# EAGLE schematic L1_2025_v1.4 (EAGLE 9.6.2)

## Sheet 1 of 5
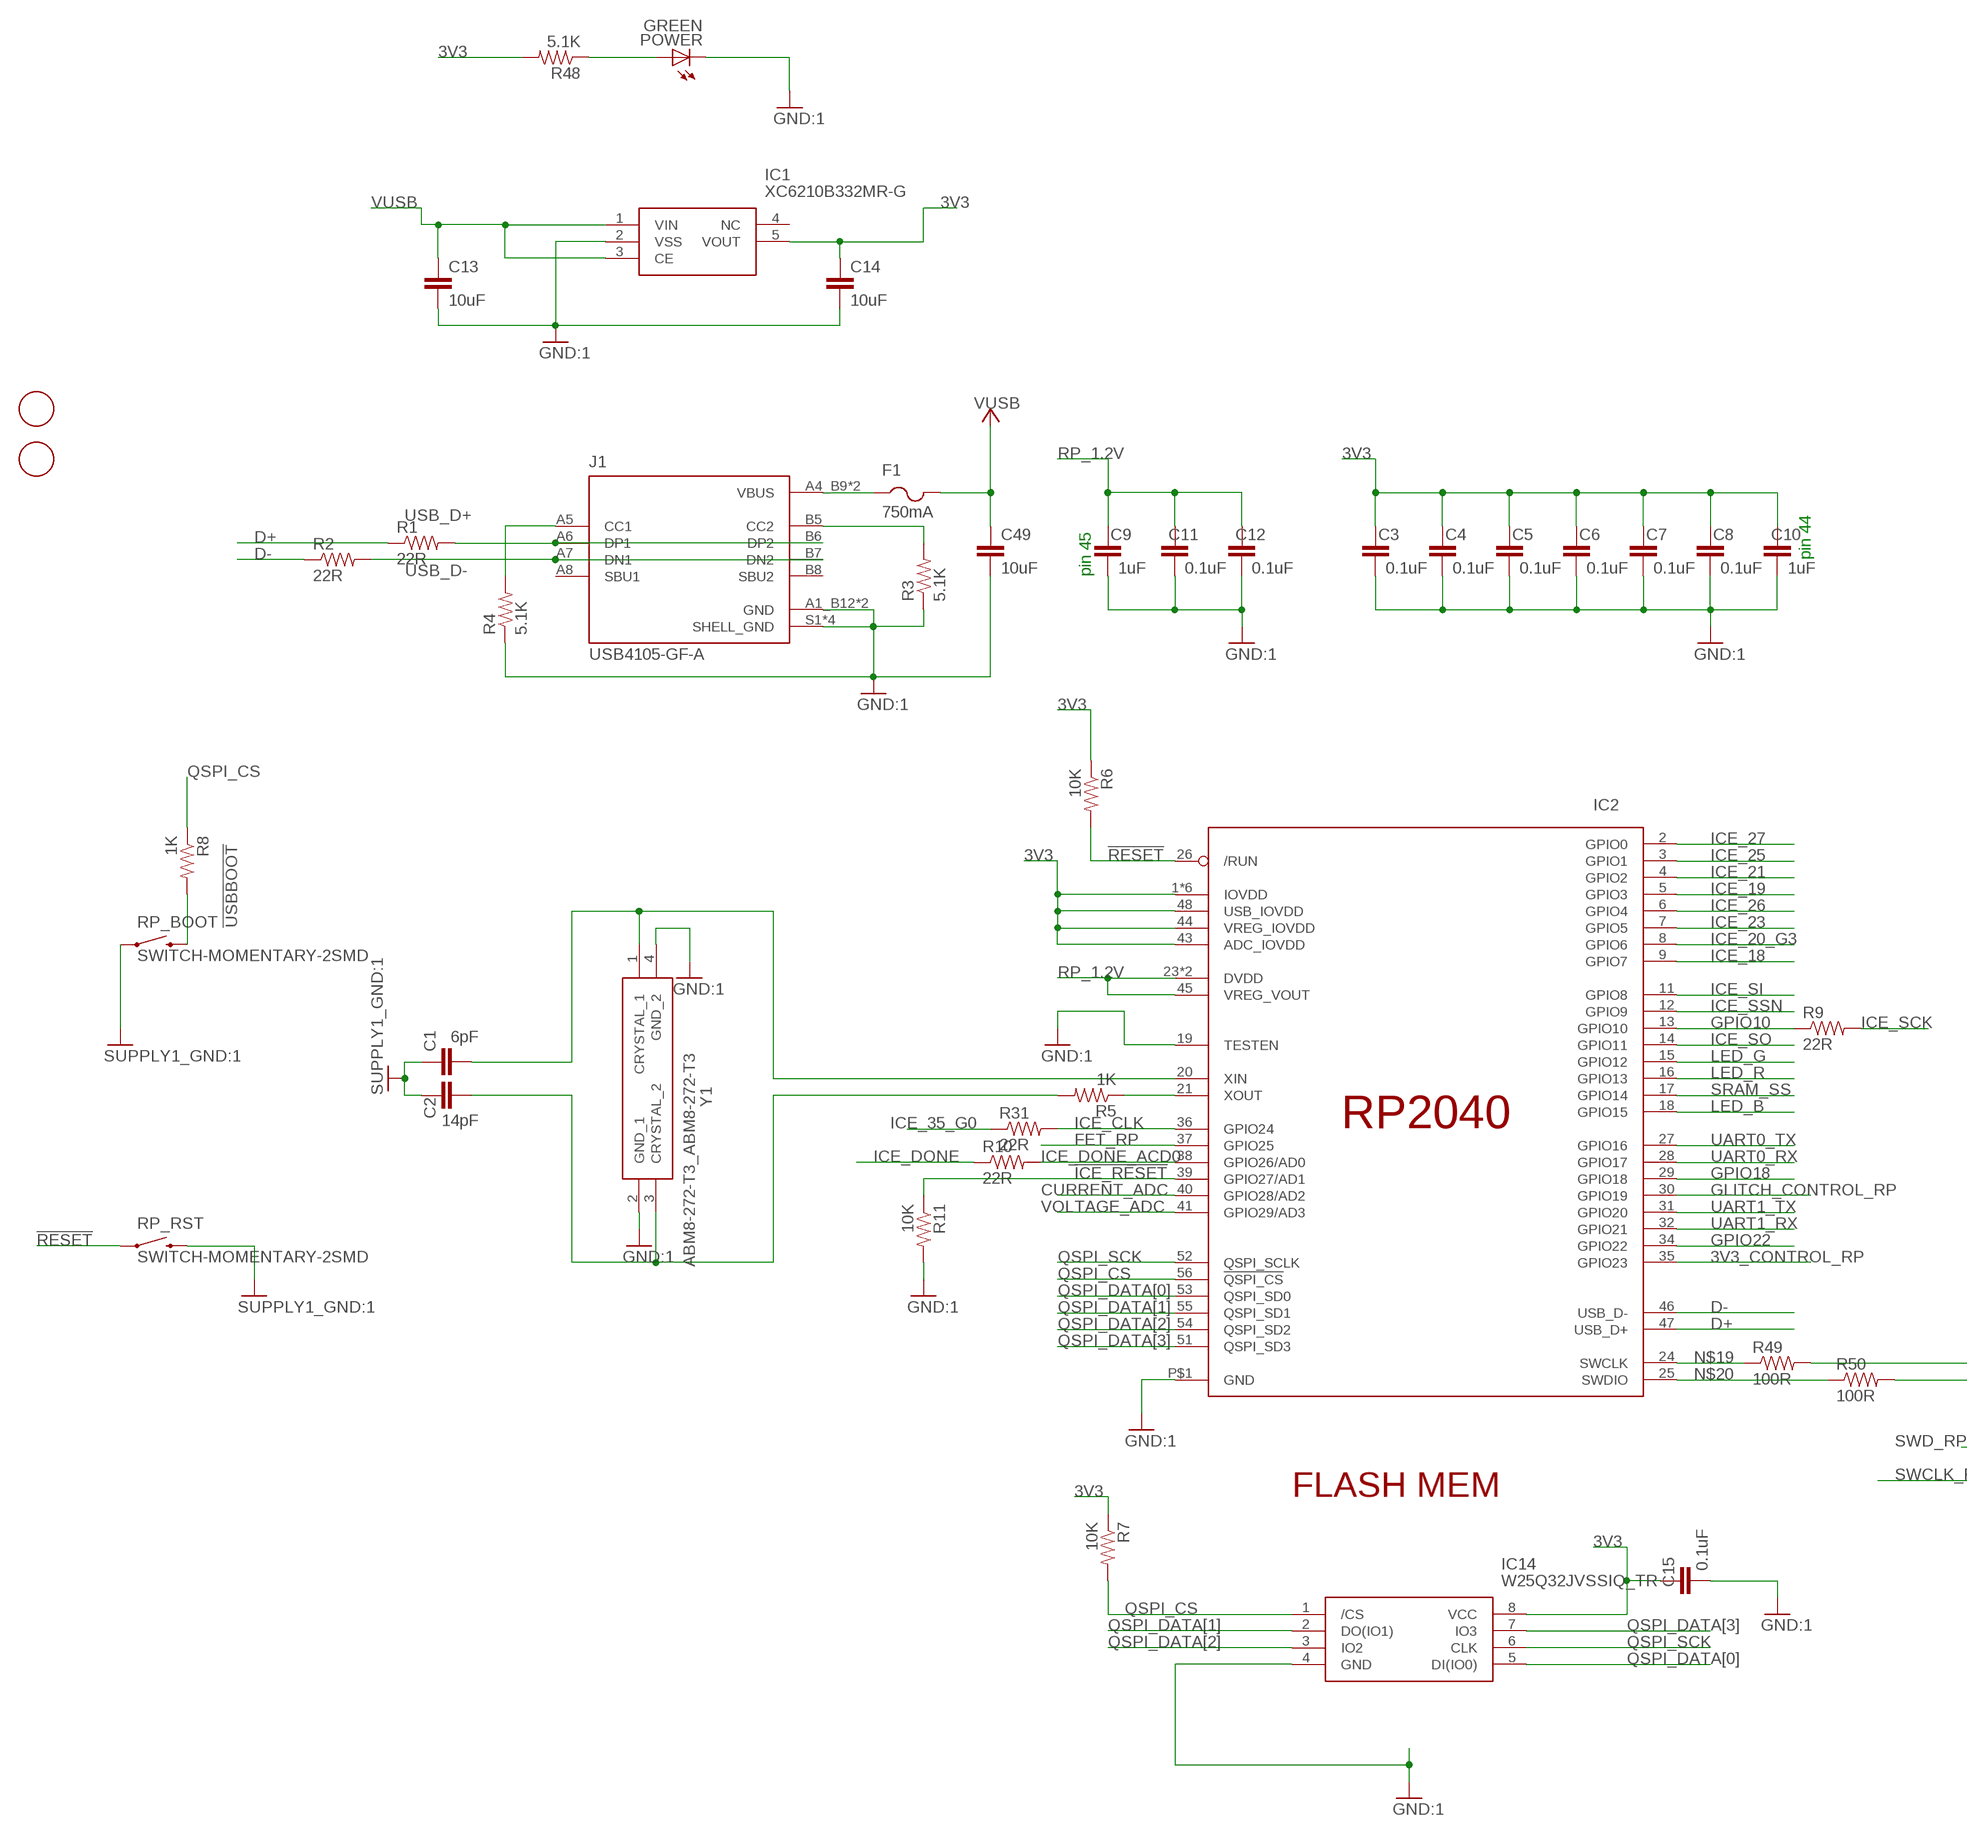
[diagram p0: schematic, sheet 1, part 1 of 2]
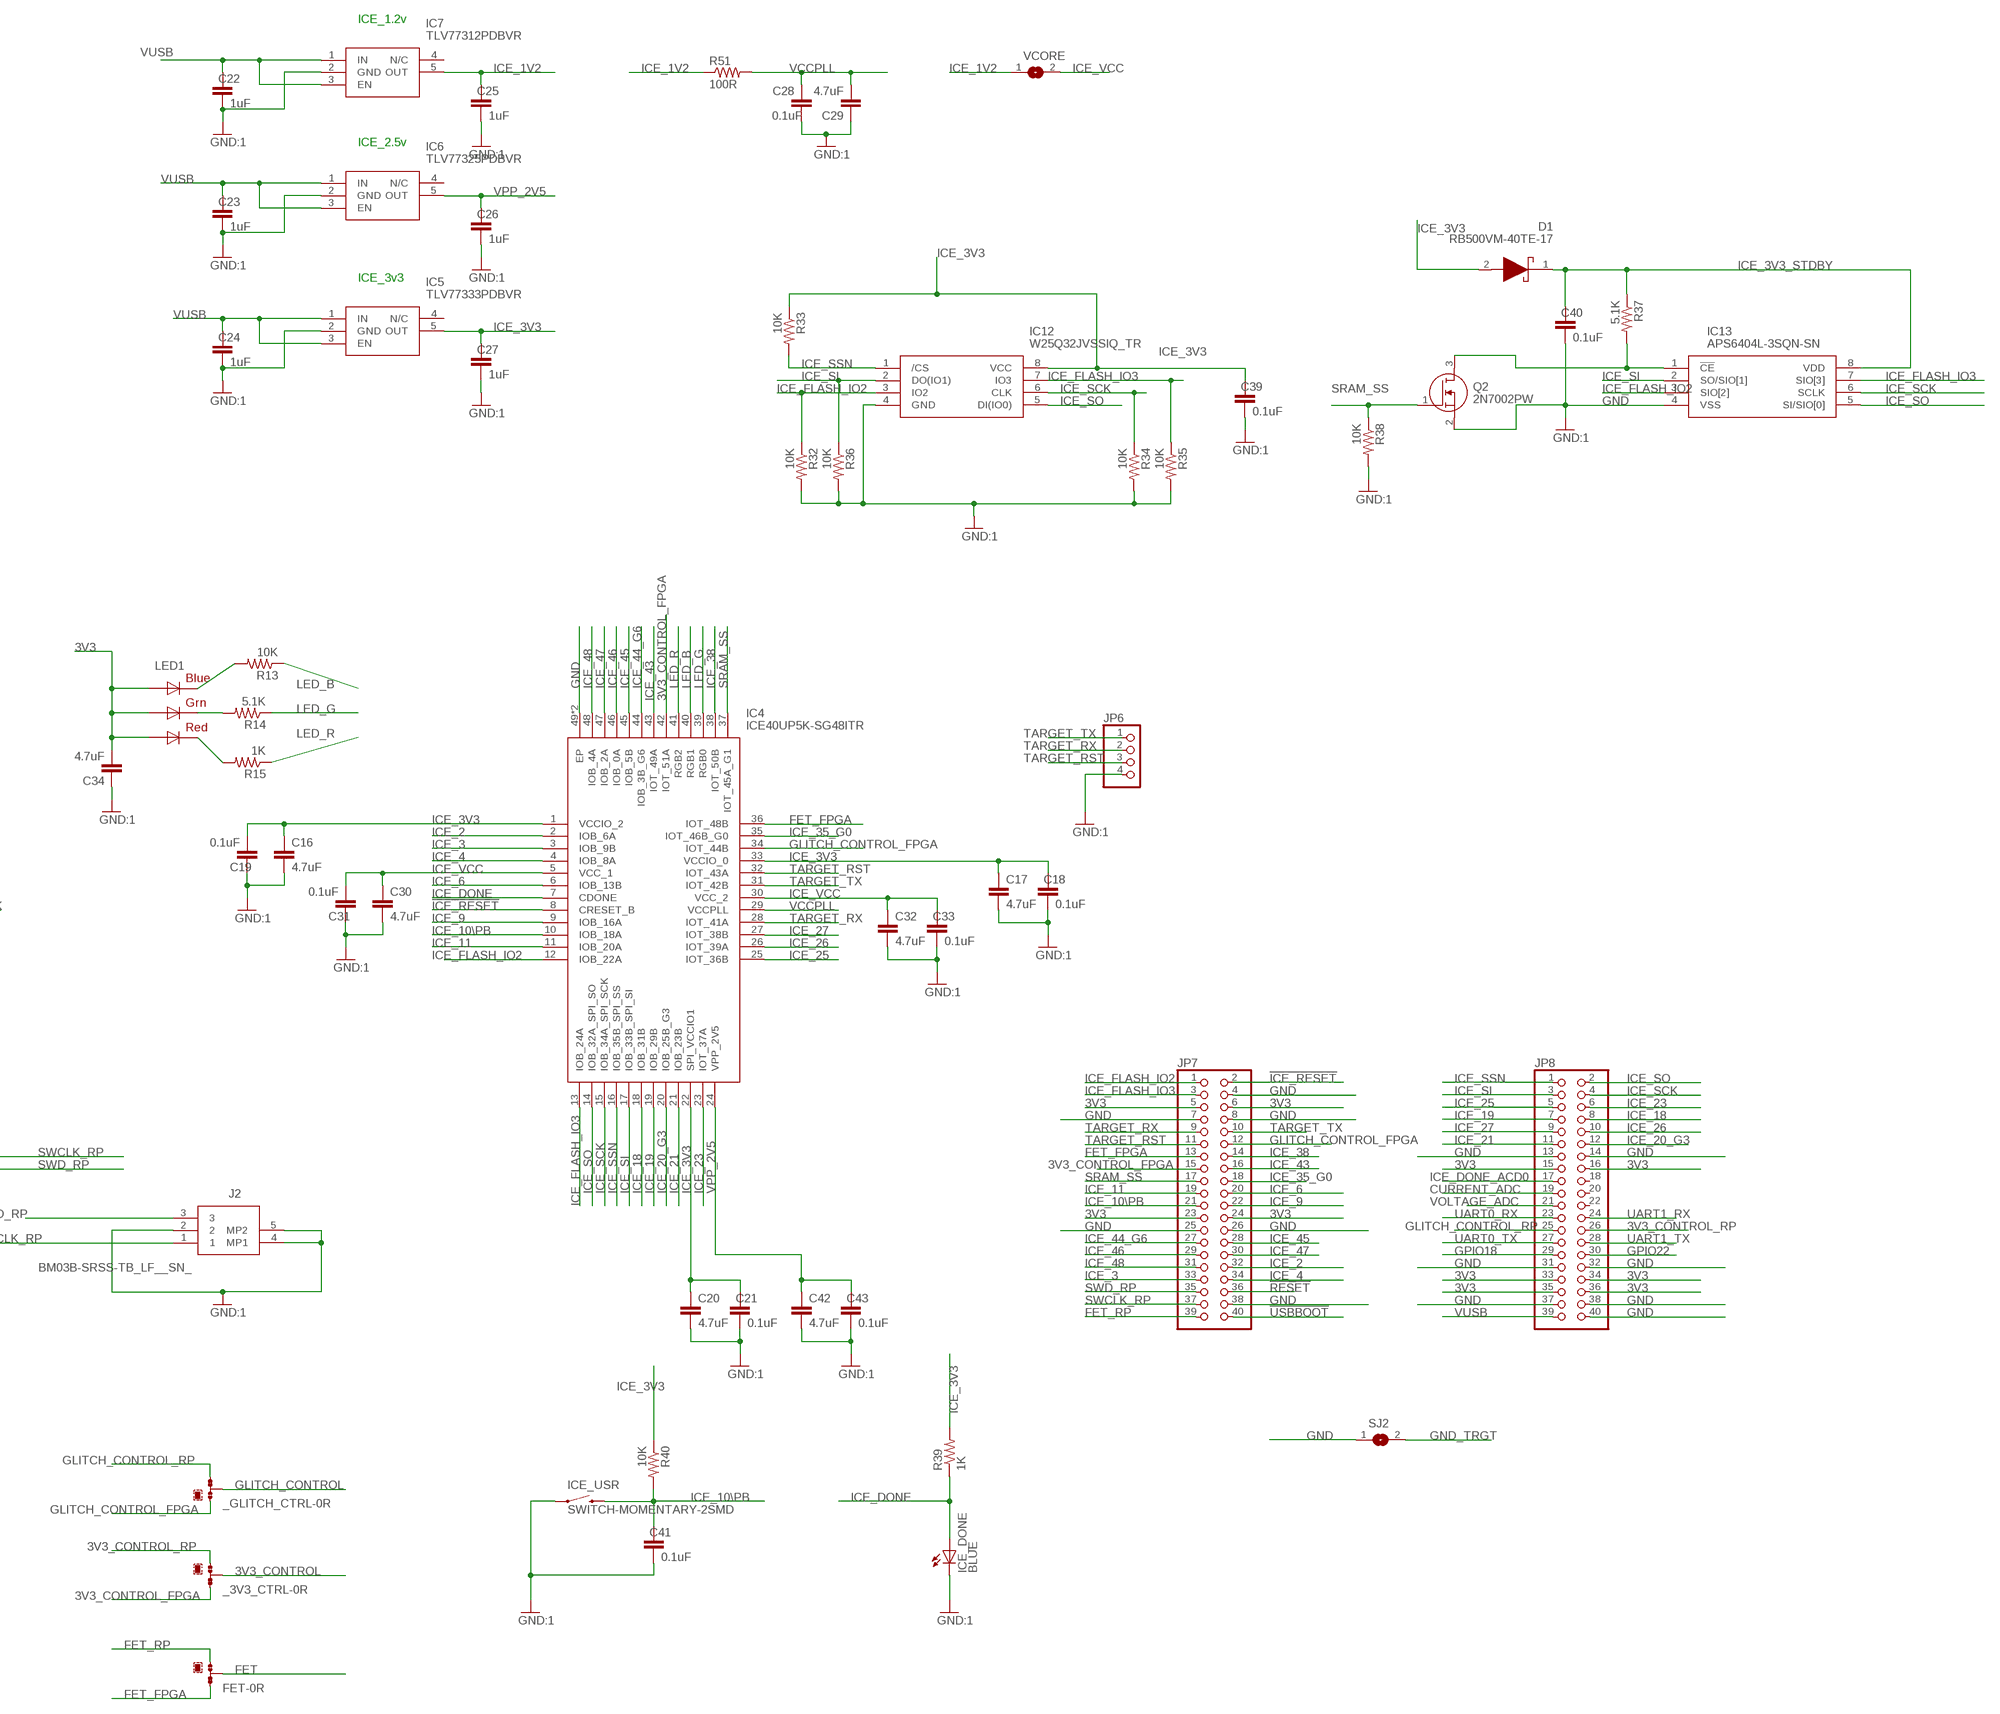
[diagram p1: schematic, sheet 1, part 2 of 2]

### Parts
_3V3_CTRL  0R-JUMPC  [C0R-JMP]
_GLITCH_CTRL  0R-JUMPC  [C0R-JMP]
AFID1  FIDUCIAL  [FIDUCIAL_1MM]
AFID2  FIDUCIAL  [FIDUCIAL_1MM]
C1  6pF  CAP0402-CAP  [0402-CAP]
C2  14pF  CAP0402-CAP  [0402-CAP]
C3  0.1uF  CAP0402-CAP  [0402-CAP]
C4  0.1uF  CAP0402-CAP  [0402-CAP]
C5  0.1uF  CAP0402-CAP  [0402-CAP]
C6  0.1uF  CAP0402-CAP  [0402-CAP]
C7  0.1uF  CAP0402-CAP  [0402-CAP]
C8  0.1uF  CAP0402-CAP  [0402-CAP]
C9  1uF  CAP0402-CAP  [0402-CAP]
C10  1uF  CAP0402-CAP  [0402-CAP]
C11  0.1uF  CAP0402-CAP  [0402-CAP]
C12  0.1uF  CAP0402-CAP  [0402-CAP]
C13  10uF  CAP0603-CAP  [0603-CAP]
C14  10uF  CAP0603-CAP  [0603-CAP]
C15  0.1uF  CAP0402-CAP  [0402-CAP]
C16  4.7uF  CAP0603-CAP  [0603-CAP]
C17  4.7uF  CAP0603-CAP  [0603-CAP]
C18  0.1uF  CAP0402-CAP  [0402-CAP]
C19  0.1uF  CAP0402-CAP  [0402-CAP]
C20  4.7uF  CAP0603-CAP  [0603-CAP]
C21  0.1uF  CAP0402-CAP  [0402-CAP]
C22  1uF  CAP0402-CAP  [0402-CAP]
C23  1uF  CAP0402-CAP  [0402-CAP]
C24  1uF  CAP0402-CAP  [0402-CAP]
C25  1uF  CAP0402-CAP  [0402-CAP]
C26  1uF  CAP0402-CAP  [0402-CAP]
C27  1uF  CAP0402-CAP  [0402-CAP]
C28  0.1uF  CAP0402-CAP  [0402-CAP]
C29  4.7uF  CAP0603-CAP  [0603-CAP]
C30  4.7uF  CAP0603-CAP  [0603-CAP]
C31  0.1uF  CAP0402-CAP  [0402-CAP]
C32  4.7uF  CAP0603-CAP  [0603-CAP]
C33  0.1uF  CAP0402-CAP  [0402-CAP]
C34  4.7uF  CAP0603-CAP  [0603-CAP]
C39  0.1uF  CAP0402-CAP  [0402-CAP]
C40  0.1uF  CAP0402-CAP  [0402-CAP]
C41  0.1uF  CAP0402-CAP  [0402-CAP]
C42  4.7uF  CAP0603-CAP  [0603-CAP]
C43  0.1uF  CAP0402-CAP  [0402-CAP]
C49  10uF  CAP0603-CAP  [0603-CAP]
D1  RB500VM-40TE-17  [RB500VM40TE17]
F1  750mA  PTCFUSE-1206  [R1206]
FET  0R-JUMPC  [C0R-JMP]
IC1  XC6210B332MR-G  [SOT95P280X130-5N]
IC2  ADAFRUIT_MICRO_RP2040_QFN56  [ADAFRUIT_MICRO_QFN56_7MM_REDUCEDEPAD]
IC4  ICE40UP5K-SG48ITR  [QFN50P700X700X100-49N]
IC5  TLV77333PDBVR  [SOT95P280X145-5N]
IC6  TLV77325PDBVR  [SOT95P280X145-5N]
IC7  TLV77312PDBVR  TLV77325PDBVR  [SOT95P280X145-5N]
IC12  W25Q32JVSSIQ_TR  [SOIC127P790X216-8N]
IC13  APS6404L-3SQN-SN  [SOIC127P600X175-8N]
IC14  W25Q32JVSSIQ_TR  [SOIC127P790X216-8N]
ICE_DONE  BLUE  LED1206  [LED-1206]
ICE_USR  SWITCH-MOMENTARY-2SMD  [TACTILE_SWITCH_SMD]
J1  USB4105-GF-A  [GCT_USB4105-GF-A]
J2  BM03B-SRSS-TB_LF__SN_  [BM03BSRSSTBLFSN]
JP6  PINHD-1X4  [1X04]
JP7  PINHD-2X20-BIG  [2X20-BIG]
JP8  PINHD-2X20-BIG  [2X20-BIG]
LED1  RGBLED5050  [RGBLED5050]
POWER  GREEN  LED1206  [LED-1206]
Q2  2N7002PW  [SOT65P210X110-3N]
R1  22R  RESISTOR0402-RES:1  [0402-RES:1]
R2  22R  RESISTOR0402-RES:1  [0402-RES:1]
R3  5.1K  RESISTOR0402-RES:1  [0402-RES:1]
R4  5.1K  RESISTOR0402-RES:1  [0402-RES:1]
R5  1K  RESISTOR0402-RES:1  [0402-RES:1]
R6  10K  RESISTOR0402-RES:1  [0402-RES:1]
R7  10K  RESISTOR0402-RES:1  [0402-RES:1]
R8  1K  RESISTOR0402-RES:1  [0402-RES:1]
R9  22R  RESISTOR0402-RES:1  [0402-RES:1]
R10  22R  RESISTOR0402-RES:1  [0402-RES:1]
R11  10K  RESISTOR0402-RES:1  [0402-RES:1]
R13  10K  RESISTOR0402-RES:1  [0402-RES:1]
R14  5.1K  RESISTOR0402-RES:1  [0402-RES:1]
R15  1K  RESISTOR0402-RES:1  [0402-RES:1]
R31  22R  RESISTOR0402-RES:1  [0402-RES:1]
R32  10K  RESISTOR0402-RES:1  [0402-RES:1]
R33  10K  RESISTOR0402-RES:1  [0402-RES:1]
R34  10K  RESISTOR0402-RES:1  [0402-RES:1]
R35  10K  RESISTOR0402-RES:1  [0402-RES:1]
R36  10K  RESISTOR0402-RES:1  [0402-RES:1]
R37  5.1K  RESISTOR0402-RES:1  [0402-RES:1]
R38  10K  RESISTOR0402-RES:1  [0402-RES:1]
R39  1K  RESISTOR0402-RES:1  [0402-RES:1]
R40  10K  RESISTOR0402-RES:1  [0402-RES:1]
R48  5.1K  RESISTOR0402-RES:1  [0402-RES:1]
R49  100R  RESISTOR0402-RES:1  [0402-RES:1]
R50  100R  RESISTOR0402-RES:1  [0402-RES:1]
R51  100R  RESISTOR0402-RES:1  [0402-RES:1]
RP_BOOT  SWITCH-MOMENTARY-2SMD  [TACTILE_SWITCH_SMD]
RP_RST  SWITCH-MOMENTARY-2SMD  [TACTILE_SWITCH_SMD]
SJ2  SJ  [SJ]
VCORE  SJ  [SJ]
Y1  ABM8-272-T3_ABM8-272-T3  [ABM8-272-T3_ABM8272T3]

### Nets
3V3: C3.2 C4.2 C5.2 C6.2 C7.2 C8.2 C10.2 C14.1 C15.2 C34.2 IC1.5(VOUT) IC2.1(IOVDD) IC2.10(IOVDD) IC2.22(IOVDD) IC2.33(IOVDD) IC2.42(IOVDD) IC2.43(ADC_IOVDD) IC2.44(VREG_IOVDD) IC2.48(USB_IOVDD) IC2.49(IOVDD) IC14.8(VCC) JP7.5 JP7.6 JP7.23 JP7.24 JP8.15 JP8.16 JP8.33 JP8.34 JP8.35 JP8.36 LED1.1(GREEN_A) LED1.2(RED_A) LED1.3(BLUE_A) R6.1 R7.1 R48.2 ; also sheet 2,3
3V3_CONTROL: _3V3_CTRL.2 ; also sheet 3
3V3_CONTROL_FPGA: _3V3_CTRL.3 IC4.42(IOT_51A) JP7.15
3V3_CONTROL_RP: _3V3_CTRL.1 IC2.35(GPIO23) JP8.26
!ICE_RESET: IC2.39(GPIO27/AD1) IC4.8(CRESET_B) JP7.2 R11.1
!RESET: IC2.26(/RUN) JP7.36 R6.2 RP_RST.1
!USBBOOT: JP7.40 R8.2 RP_BOOT.3
CURRENT_ADC: IC2.40(GPIO28/AD2) JP8.19 ; also sheet 4
D+: IC2.47(USB_D+) R1.1
D-: IC2.46(USB_D-) R2.1
FET: FET.2 ; also sheet 3
FET_FPGA: FET.3 IC4.36(IOT_48B) JP7.13
FET_RP: FET.1 IC2.37(GPIO25) JP7.39
GLITCH_CONTROL: _GLITCH_CTRL.2 ; also sheet 3
GLITCH_CONTROL_FPGA: _GLITCH_CTRL.3 IC4.34(IOT_44B) JP7.12
GLITCH_CONTROL_RP: _GLITCH_CTRL.1 IC2.30(GPIO19) JP8.25
GND: C1.1 C2.1 C3.1 C4.1 C5.1 C6.1 C7.1 C8.1 C9.1 C10.1 C11.1 C12.1 C13.2 C14.2 C15.1 C16.2 C17.2 C18.1 C19.2 C20.2 C21.1 C22.1 C23.1 C24.1 C25.1 C26.1 C27.1 C28.1 C29.1 C30.2 C31.2 C32.2 C33.1 C34.1 C39.1 C40.1 C41.1 C42.2 C43.1 C49.2 IC1.2(VSS) IC2.19(TESTEN) IC2.P$1(GND) IC4.49(EP) IC4.P$1(EP) IC5.2(GND) IC6.2(GND) IC7.2(GND) IC12.4(GND) IC13.4(VSS) IC14.4(GND) ICE_DONE.C ICE_USR.1 J1.A1_B12(GND) J1.B1_A12(GND) J1.S1(SHELL_GND) J1.S2(SHELL_GND) J1.S3(SHELL_GND) J1.S4(SHELL_GND) J2.2 J2.4(MP1) J2.5(MP2) JP6.4 JP7.4 JP7.7 JP7.8 JP7.25 JP7.26 JP7.38 JP8.13 JP8.14 JP8.31 JP8.32 JP8.37 JP8.38 JP8.40 POWER.C Q2.2(S) R3.1 R4.1 R11.2 R32.2 R34.2 R35.2 R36.2 R38.2 RP_BOOT.1 RP_RST.3 SJ2.1 Y1.2(GND_1) Y1.4(GND_2) ; supply symbol labelled GND:1, SUPPLY1_GND:1 ; also sheet 2,3,4
GND_TRGT: SJ2.2 ; also sheet 5
GPIO10: IC2.13(GPIO10) R9.1
GPIO18: IC2.29(GPIO18) JP8.29 ; also sheet 2
GPIO22: IC2.34(GPIO22) JP8.30 ; also sheet 2
ICE_1V2: C25.2 IC7.5(OUT) R51.1 VCORE.1
ICE_2: IC4.2(IOB_6A) JP7.32
ICE_3: IC4.3(IOB_9B) JP7.33
ICE_3V3: C16.1 C17.1 C18.2 C19.1 C20.1 C21.2 C27.2 C39.2 D1.2(A) IC4.1(VCCIO_2) IC4.22(SPI_VCCIO1) IC4.33(VCCIO_0) IC5.5(OUT) IC12.8(VCC) R33.1 R39.2 R40.1
ICE_3V3_STDBY: C40.2 D1.1(K) IC13.8(VDD) R37.1
ICE_4: IC4.4(IOB_8A) JP7.34
ICE_6: IC4.6(IOB_13B) JP7.20
ICE_9: IC4.9(IOB_16A) JP7.22
ICE_10\PB: C41.2 IC4.10(IOB_18A) ICE_USR.3 JP7.21 R40.2
ICE_11: IC4.11(IOB_20A) JP7.19
ICE_18: IC2.9(GPIO7) IC4.18(IOB_31B) JP8.8
ICE_19: IC2.5(GPIO3) IC4.19(IOB_29B) JP8.7
ICE_20_G3: IC2.8(GPIO6) IC4.20(IOB_25B_G3) JP8.12
ICE_21: IC2.4(GPIO2) IC4.21(IOB_23B) JP8.11
ICE_23: IC2.7(GPIO5) IC4.23(IOT_37A) JP8.6
ICE_25: IC2.3(GPIO1) IC4.25(IOT_36B) JP8.5
ICE_26: IC2.6(GPIO4) IC4.26(IOT_39A) JP8.10
ICE_27: IC2.2(GPIO0) IC4.27(IOT_38B) JP8.9
ICE_35_G0: IC4.35(IOT_46B_G0) JP7.18 R31.1
ICE_38: IC4.38(IOT_50B) JP7.14
ICE_43: IC4.43(IOT_49A) JP7.16
ICE_44_G6: IC4.44(IOB_3B_G6) JP7.27
ICE_45: IC4.45(IOB_5B) JP7.28
ICE_46: IC4.46(IOB_0A) JP7.29
ICE_47: IC4.47(IOB_2A) JP7.30
ICE_48: IC4.48(IOB_4A) JP7.31
ICE_CLK: IC2.36(GPIO24) R31.2
ICE_DONE: IC4.7(CDONE) ICE_DONE.A R10.1 R39.1
ICE_DONE_ACD0: IC2.38(GPIO26/AD0) JP8.17 R10.2
ICE_FLASH_IO2: IC4.12(IOB_22A) IC12.3(IO2) IC13.3(SIO[2]) JP7.1 R32.1
ICE_FLASH_IO3: IC4.13(IOB_24A) IC12.7(IO3) IC13.7(SIO[3]) JP7.3 R35.1
ICE_SCK: IC4.15(IOB_34A_SPI_SCK) IC12.6(CLK) IC13.6(SCLK) JP8.4 R9.2 R34.1
ICE_SI: IC2.11(GPIO8) IC4.17(IOB_33B_SPI_SI) IC12.2(DO(IO1)) IC13.2(SO/SIO[1]) JP8.3 R36.1
ICE_SO: IC2.14(GPIO11) IC4.14(IOB_32A_SPI_SO) IC12.5(DI(IO0)) IC13.5(SI/SIO[0]) JP8.2
ICE_SSN: IC2.12(GPIO9) IC4.16(IOB_35B_SPI_SS) IC12.1(/CS) JP8.1 R33.2
ICE_VCC: C30.1 C31.1 C32.1 C33.2 IC4.5(VCC_1) IC4.30(VCC_2) VCORE.2
LED_B: IC2.18(GPIO15) IC4.40(RGB1) R13.1
LED_G: IC2.15(GPIO12) IC4.39(RGB0) R14.1
LED_R: IC2.16(GPIO13) IC4.41(RGB2) R15.1
N$1: C2.2 R5.2 Y1.3(CRYSTAL_2)
N$2: IC2.21(XOUT) R5.1
N$3: C1.2 IC2.20(XIN) Y1.1(CRYSTAL_1)
N$4: LED1.4(BLUE_C) R13.2
N$5: LED1.6(GREEN_C) R14.2
N$6: LED1.5(RED_C) R15.2
N$7: J1.A5(CC1) R4.2
N$8: J1.B5(CC2) R3.2
N$16: IC13.1(!CE) Q2.3(D) R37.2
N$17: F1.1 J1.A4_B9(VBUS) J1.B4_A9(VBUS)
N$18: POWER.A R48.1
N$19: IC2.24(SWCLK) R49.1
N$20: IC2.25(SWDIO) R50.1
QSPI_CS: IC2.56(!QSPI_CS) IC14.1(/CS) R7.2 R8.1
QSPI_DATA[0]: IC2.53(QSPI_SD0) IC14.5(DI(IO0))
QSPI_DATA[1]: IC2.55(QSPI_SD1) IC14.2(DO(IO1))
QSPI_DATA[2]: IC2.54(QSPI_SD2) IC14.3(IO2)
QSPI_DATA[3]: IC2.51(QSPI_SD3) IC14.7(IO3)
QSPI_SCK: IC2.52(QSPI_SCLK) IC14.6(CLK)
RP_1.2V: C9.2 C11.2 C12.2 IC2.23(DVDD) IC2.45(VREG_VOUT) IC2.50(DVDD)
SRAM_SS: IC2.17(GPIO14) IC4.37(IOT_45A_G1) JP7.17 Q2.1(G) R38.1
SWCLK_RP: J2.1 JP7.37 R49.2
SWD_RP: J2.3 JP7.35 R50.2
TARGET_RST: IC4.32(IOT_43A) JP6.3 JP7.11
TARGET_RX: IC4.28(IOT_41A) JP6.2 JP7.9
TARGET_TX: IC4.31(IOT_42B) JP6.1 JP7.10
UART0_RX: IC2.28(GPIO17) JP8.23 ; also sheet 2
UART0_TX: IC2.27(GPIO16) JP8.27 ; also sheet 2
UART1_RX: IC2.32(GPIO21) JP8.24 ; also sheet 2
UART1_TX: IC2.31(GPIO20) JP8.28 ; also sheet 2
USB_D+: J1.A6(DP1) J1.B6(DP2) R1.2
USB_D-: J1.A7(DN1) J1.B7(DN2) R2.2
VCCPLL: C28.2 C29.2 IC4.29(VCCPLL) R51.2
VOLTAGE_ADC: IC2.41(GPIO29/AD3) JP8.21 ; also sheet 4
VPP_2V5: C26.2 C42.1 C43.2 IC4.24(VPP_2V5) IC6.5(OUT)
VUSB: C13.1 C22.2 C23.2 C24.2 C49.1 F1.2 IC1.1(VIN) IC1.3(CE) IC5.1(IN) IC5.3(EN) IC6.1(IN) IC6.3(EN) IC7.1(IN) IC7.3(EN) JP8.39 ; supply symbol labelled VCC:1 ; also sheet 3
Unconnected: IC1.4(NC) IC5.4(N/C) IC6.4(N/C) IC7.4(N/C) J1.A8(SBU1) J1.B8(SBU2) JP8.18 JP8.20 JP8.22

### Notes on the sheet
- ICE_1.2v
- ICE_2.5v
- ICE_3v3
- pin 44
- pin 45
- FLASH MEM

## Sheet 2 of 5
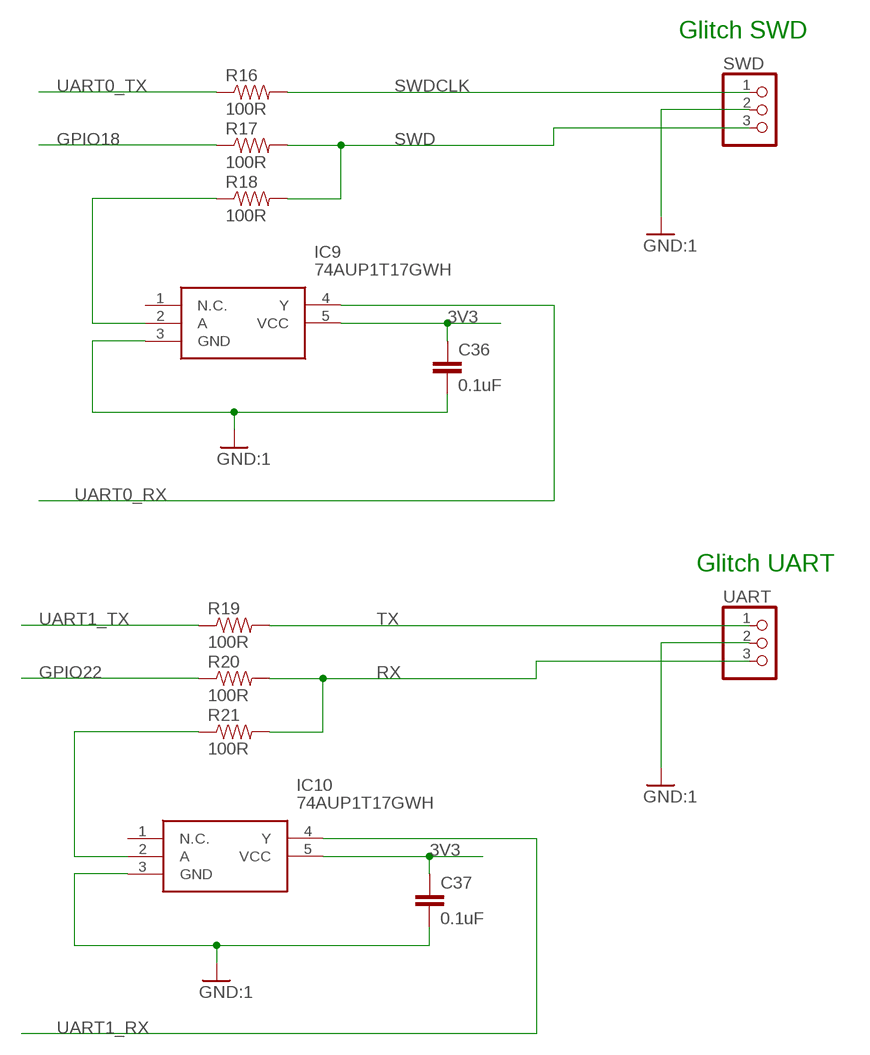
[diagram p2: schematic, sheet 2]

### Parts
C36  0.1uF  CAP0402-CAP  [0402-CAP]
C37  0.1uF  CAP0402-CAP  [0402-CAP]
IC9  74AUP1T17GWH  [SOT65P212X110-5N]
IC10  74AUP1T17GWH  [SOT65P212X110-5N]
R16  100R  RESISTOR0402-RES:1  [0402-RES:1]
R17  100R  RESISTOR0402-RES:1  [0402-RES:1]
R18  100R  RESISTOR0402-RES:1  [0402-RES:1]
R19  100R  RESISTOR0402-RES:1  [0402-RES:1]
R20  100R  RESISTOR0402-RES:1  [0402-RES:1]
R21  100R  RESISTOR0402-RES:1  [0402-RES:1]
SWD  PINHD-1X3  [1X03]
UART  PINHD-1X3  [1X03]

### Nets
3V3: C36.1 C37.1 IC9.5(VCC) IC10.5(VCC) ; also sheet 1,3
GND: C36.2 C37.2 IC9.3(GND) IC10.3(GND) SWD.2 UART.2 ; supply symbol labelled GND:1 ; also sheet 1,3,4
GPIO18: R17.1 ; also sheet 1
GPIO22: R20.1 ; also sheet 1
N$9: IC10.2(A) R21.1
N$12: IC9.2(A) R18.1
RX: R20.2 R21.2 UART.3
SWD: R17.2 R18.2 SWD.3
SWDCLK: R16.2 SWD.1
TX: R19.2 UART.1
UART0_RX: IC9.4(Y) ; also sheet 1
UART0_TX: R16.1 ; also sheet 1
UART1_RX: IC10.4(Y) ; also sheet 1
UART1_TX: R19.1 ; also sheet 1
Unconnected: IC9.1(N.C.) IC10.1(N.C.)

### Notes on the sheet
- Glitch SWD
- Glitch UART

## Sheet 3 of 5
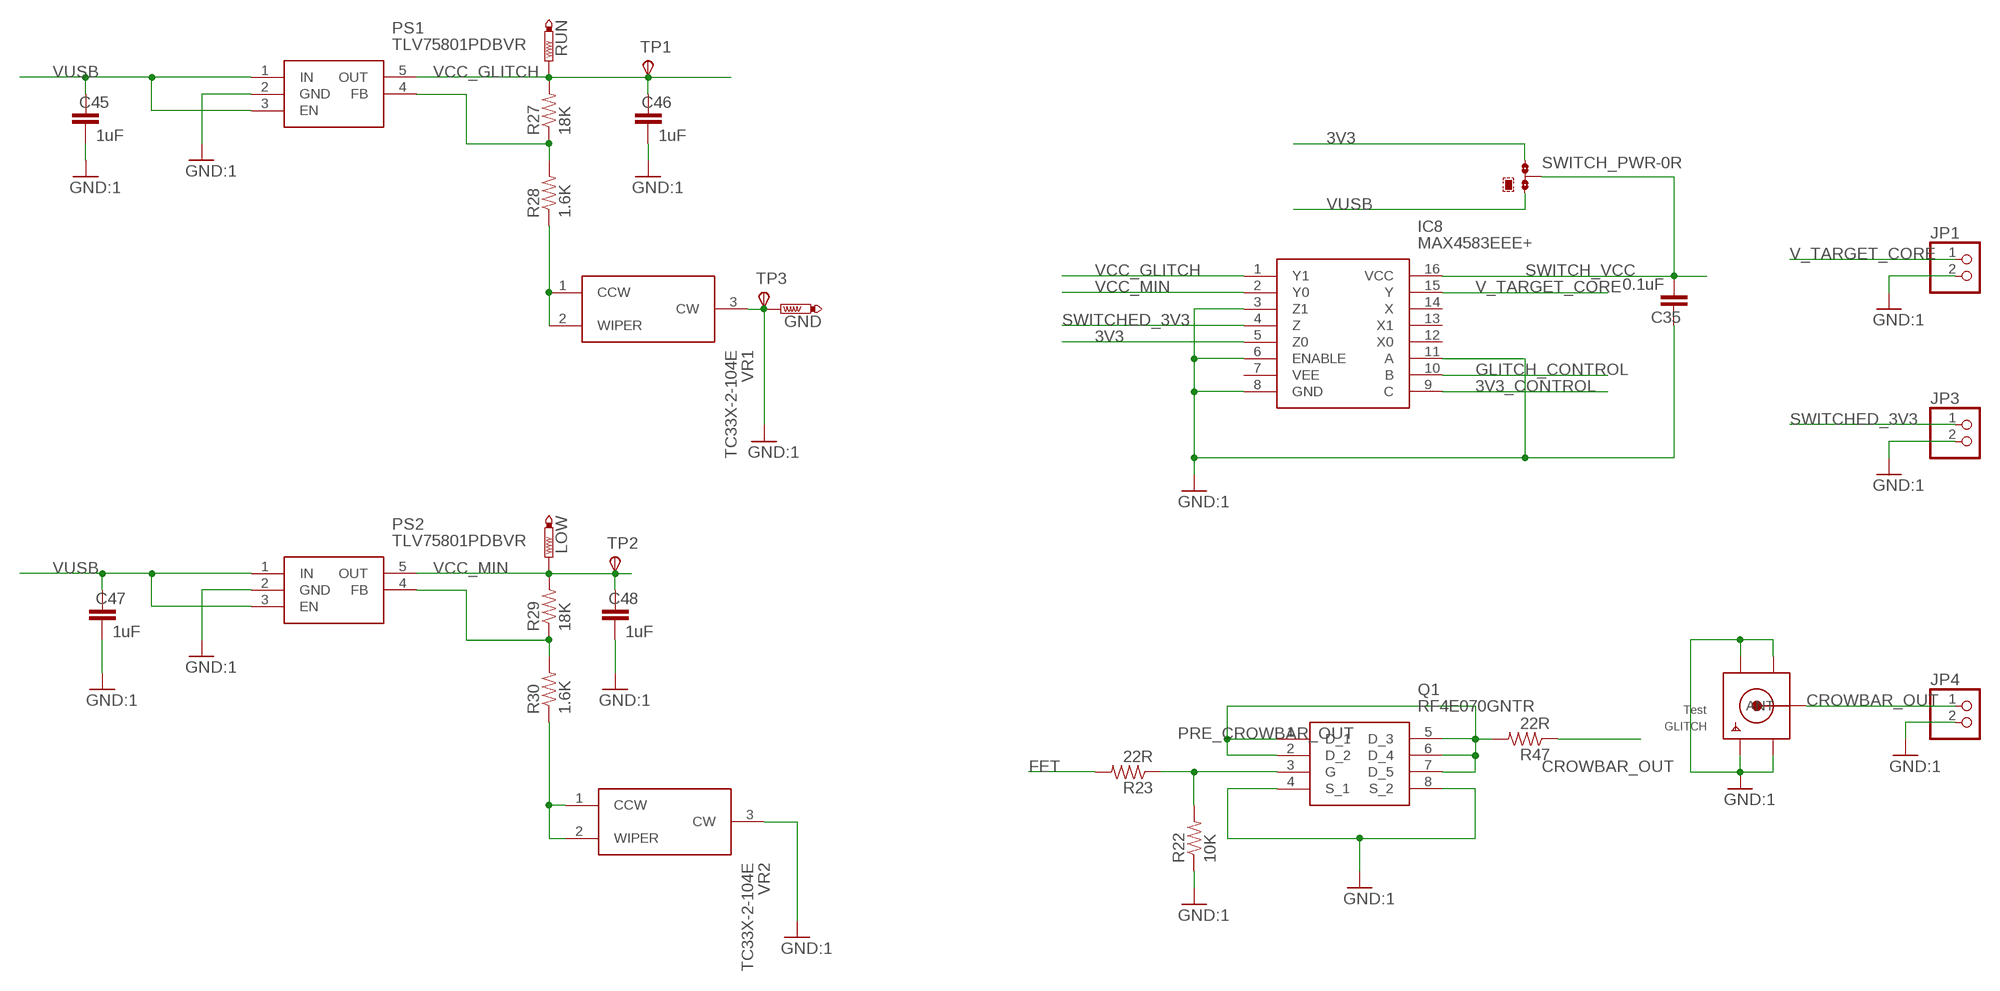
[diagram p3: schematic, sheet 3]

### Parts
C35  0.1uF  CAP0402-CAP  [0402-CAP]
C45  1uF  CAP0402-CAP  [0402-CAP]
C46  1uF  CAP0402-CAP  [0402-CAP]
C47  1uF  CAP0402-CAP  [0402-CAP]
C48  1uF  CAP0402-CAP  [0402-CAP]
GLITCH  Test  SMACONNECTOR_EDGE  [SMA_EDGELAUNCH]
GND  PTR1PAD1-13  [P1-13]
IC8  MAX4583EEE+  [SOP64P602X175-16N]
JP1  PINHD-1X2  [1X02]
JP3  PINHD-1X2  [1X02]
JP4  PINHD-1X2  [1X02]
LOW  PTR1PAD1-13  [P1-13]
PS1  TLV75801PDBVR  [SOT95P280X145-5N]
PS2  TLV75801PDBVR  [SOT95P280X145-5N]
Q1  RF4E070GNTR  [RF4E070GNTR]
R22  10K  RESISTOR0402-RES:1  [0402-RES:1]
R23  22R  RESISTOR0402-RES:1  [0402-RES:1]
R27  18K  RESISTOR0402-RES:1  [0402-RES:1]
R28  1.6K  RESISTOR0402-RES:1  [0402-RES:1]
R29  18K  RESISTOR0402-RES:1  [0402-RES:1]
R30  1.6K  RESISTOR0402-RES:1  [0402-RES:1]
R47  22R  RESISTOR0402-RES:1  [0402-RES:1]
RUN  PTR1PAD1-13  [P1-13]
SWITCH_PWR  0R-JUMPC  [C0R-JMP]
TP1  TESTPAD_TPSTP20R  [TESTPAD_TP20R:1]
TP2  TESTPAD_TPSTP20R  [TESTPAD_TP20R:1]
TP3  TESTPAD_TPSTP20R  [TESTPAD_TP20R:1]
VR1  TC33X-2-104E  [TC33X2503E]
VR2  TC33X-2-104E  [TC33X2503E]

### Nets
3V3: IC8.5(Z0) SWITCH_PWR.1 ; also sheet 1,2
3V3_CONTROL: IC8.9(C) ; also sheet 1
CROWBAR_OUT: GLITCH.P(ANT) JP4.1 R47.1
FET: R23.2 ; also sheet 1
GLITCH_CONTROL: IC8.10(B) ; also sheet 1
GND: C35.2 C45.1 C46.1 C47.1 C48.1 GLITCH.GND@1(GND4) GLITCH.GND@2(GND3) GLITCH.GND@3(GND2) GLITCH.GND@4(GND1) GND.TP IC8.3(Z1) IC8.6(ENABLE) IC8.8(GND) IC8.11(A) JP1.2 JP3.2 JP4.2 PS1.2(GND) PS2.2(GND) Q1.4(S_1) Q1.8(S_2) R22.1 TP3.TP(PP) VR1.3(CW) VR2.3(CW) ; supply symbol labelled GND:1 ; also sheet 1,2,4
N$10: PS1.4(FB) R27.1 R28.2
N$11: Q1.3(G) R22.2 R23.1
N$13: R28.1 VR1.1(CCW) VR1.2(WIPER)
N$14: PS2.4(FB) R29.1 R30.2
N$15: R30.1 VR2.1(CCW) VR2.2(WIPER)
PRE_CROWBAR_OUT: Q1.1(D_1) Q1.2(D_2) Q1.5(D_3) Q1.6(D_4) Q1.7(D_5) R47.2
SWITCH_VCC: C35.1 IC8.16(VCC) SWITCH_PWR.2
SWITCHED_3V3: IC8.4(Z) JP3.1
V_TARGET_CORE: IC8.15(Y) JP1.1
VCC_GLITCH: C46.2 IC8.1(Y1) PS1.5(OUT) R27.2 RUN.TP TP1.TP(PP)
VCC_MIN: C48.2 IC8.2(Y0) LOW.TP PS2.5(OUT) R29.2 TP2.TP(PP)
VUSB: C45.2 C47.2 PS1.1(IN) PS1.3(EN) PS2.1(IN) PS2.3(EN) SWITCH_PWR.3 ; also sheet 1
Unconnected: IC8.7(VEE) IC8.12(X0) IC8.13(X1) IC8.14(X)

## Sheet 4 of 5
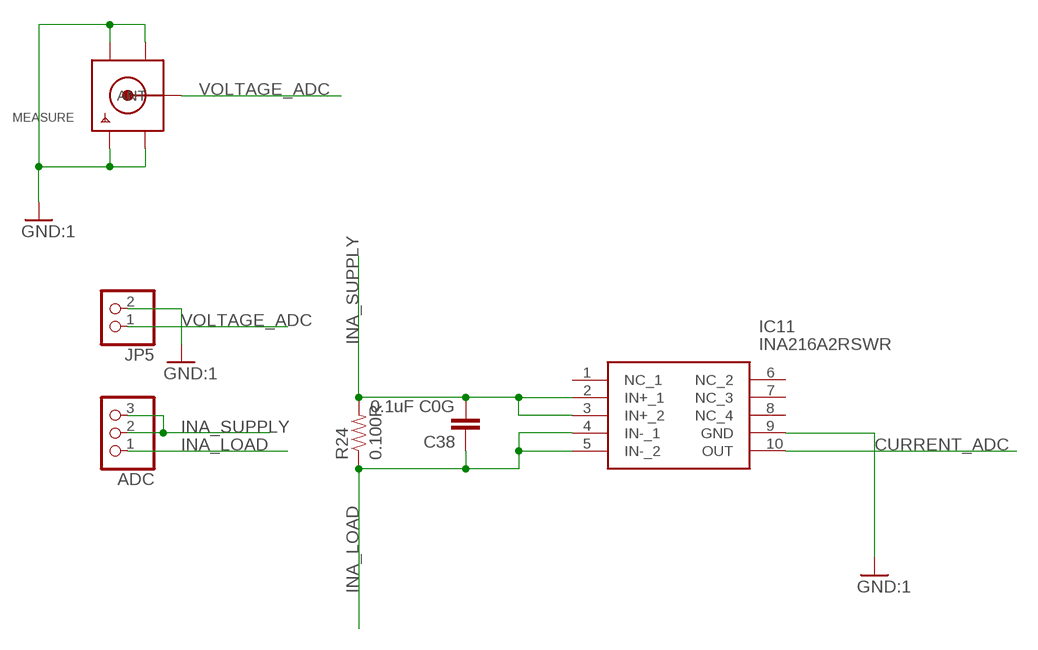
[diagram p4: schematic, sheet 4]

### Parts
ADC  PINHD-1X3:1  [1X03:1]
C38  0.1uF C0G  CAP0402-CAP  [0402-CAP]
IC11  INA216A2RSWR  [INA216A2RSWR]
JP5  PINHD-1X2  [1X02]
MEASURE  SMACONNECTOR_EDGE  [SMA_EDGELAUNCH]
R24  0.100R  RESISTOR2512:1  [R2512]

### Nets
CURRENT_ADC: IC11.10(OUT) ; also sheet 1
GND: IC11.9(GND) JP5.2 MEASURE.GND@1(GND4) MEASURE.GND@2(GND3) MEASURE.GND@3(GND2) MEASURE.GND@4(GND1) ; supply symbol labelled GND:1 ; also sheet 1,2,3
INA_LOAD: ADC.1 C38.1 IC11.4(IN-_1) IC11.5(IN-_2) R24.1
INA_SUPPLY: ADC.2 ADC.3 C38.2 IC11.2(IN+_1) IC11.3(IN+_2) R24.2
VOLTAGE_ADC: JP5.1 MEASURE.P(ANT) ; also sheet 1
Unconnected: IC11.1(NC_1) IC11.6(NC_2) IC11.7(NC_3) IC11.8(NC_4)

## Sheet 5 of 5
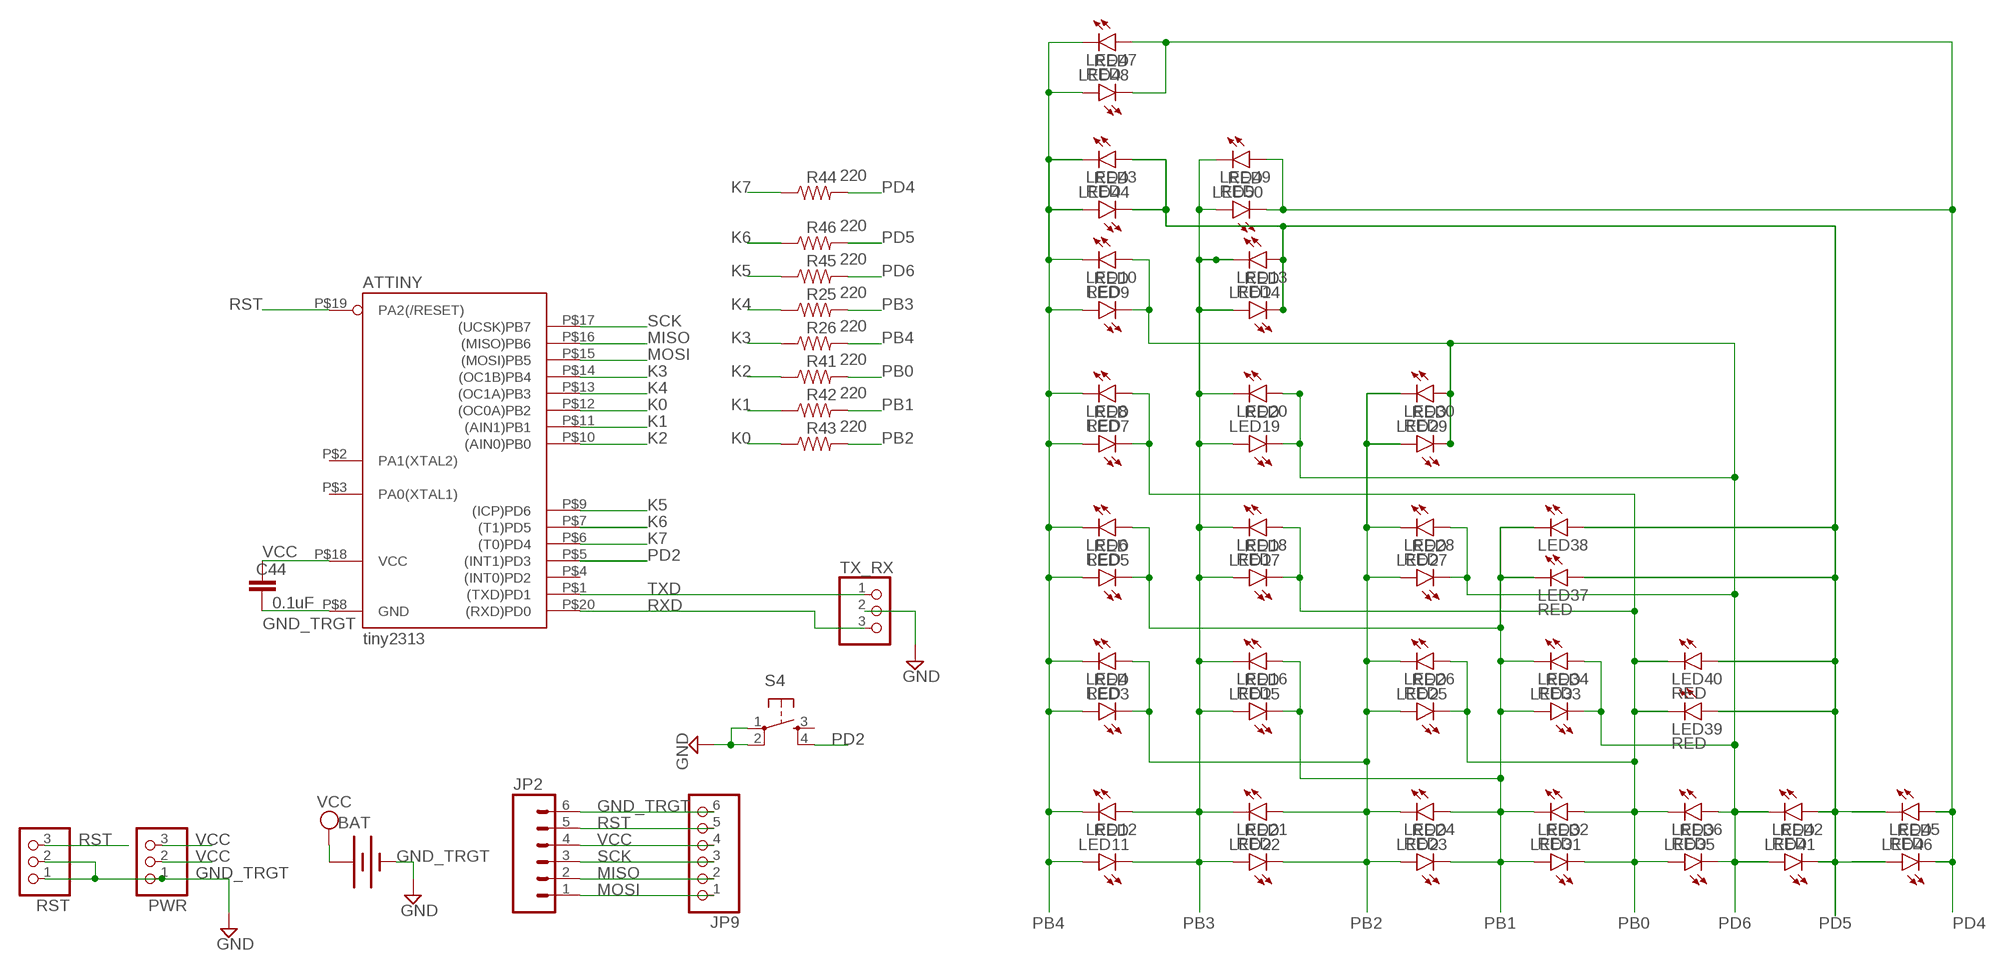
[diagram p5: schematic, sheet 5]

### Parts
ATTINY  tiny2313  TINY2313-*M*  [MLF20]
BAT  SPARKFUN_BATTERYSPARKFUN_BATTCOMM_20MM_LINX  [SPARKFUN_BATTCOM_20MM_LINX]
C44  0.1uF  CAP0402-CAP  [0402-CAP]
JP2  SPARKFUN-CONNECTORS_M06SMD-FEMALE-V2  [SPARKFUN-CONNECTORS_1X06-SMD-FEMALE-V2]
JP9  ADAFRUIT_PINHD-1X6CLEAN  [ADAFRUIT_1X06-CLEAN]
LED3  RED  LEDCHIPLED_1206:1  [CHIPLED_1206]
LED4  RED  LEDCHIPLED_1206:1  [CHIPLED_1206]
LED5  RED  LEDCHIPLED_1206:1  [CHIPLED_1206]
LED6  RED  LEDCHIPLED_1206:1  [CHIPLED_1206]
LED7  RED  LEDCHIPLED_1206:1  [CHIPLED_1206]
LED8  RED  LEDCHIPLED_1206:1  [CHIPLED_1206]
LED9  RED  LEDCHIPLED_1206:1  [CHIPLED_1206]
LED10  RED  LEDCHIPLED_1206:1  [CHIPLED_1206]
LED11  RED  LEDCHIPLED_1206:1  [CHIPLED_1206]
LED12  LEDCHIPLED_1206:1  [CHIPLED_1206]
LED13  RED  LEDCHIPLED_1206:1  [CHIPLED_1206]
LED14  RED  LEDCHIPLED_1206:1  [CHIPLED_1206]
LED15  RED  LEDCHIPLED_1206:1  [CHIPLED_1206]
LED16  RED  LEDCHIPLED_1206:1  [CHIPLED_1206]
LED17  RED  LEDCHIPLED_1206:1  [CHIPLED_1206]
LED18  RED  LEDCHIPLED_1206:1  [CHIPLED_1206]
LED19  RED  LEDCHIPLED_1206:1  [CHIPLED_1206]
LED20  LEDCHIPLED_1206:1  [CHIPLED_1206]
LED21  RED  LEDCHIPLED_1206:1  [CHIPLED_1206]
LED22  RED  LEDCHIPLED_1206:1  [CHIPLED_1206]
LED23  RED  LEDCHIPLED_1206:1  [CHIPLED_1206]
LED24  RED  LEDCHIPLED_1206:1  [CHIPLED_1206]
LED25  RED  LEDCHIPLED_1206:1  [CHIPLED_1206]
LED26  RED  LEDCHIPLED_1206:1  [CHIPLED_1206]
LED27  RED  LEDCHIPLED_1206:1  [CHIPLED_1206]
LED28  RED  LEDCHIPLED_1206:1  [CHIPLED_1206]
LED29  RED  LEDCHIPLED_1206:1  [CHIPLED_1206]
LED30  RED  LEDCHIPLED_1206:1  [CHIPLED_1206]
LED31  RED  LEDCHIPLED_1206:1  [CHIPLED_1206]
LED32  RED  LEDCHIPLED_1206:1  [CHIPLED_1206]
LED33  RED  LEDCHIPLED_1206:1  [CHIPLED_1206]
LED34  RED  LEDCHIPLED_1206:1  [CHIPLED_1206]
LED35  RED  LEDCHIPLED_1206:1  [CHIPLED_1206]
LED36  RED  LEDCHIPLED_1206:1  [CHIPLED_1206]
LED37  RED  LEDCHIPLED_1206:1  [CHIPLED_1206]
LED38  LEDCHIPLED_1206:1  [CHIPLED_1206]
LED39  RED  LEDCHIPLED_1206:1  [CHIPLED_1206]
LED40  RED  LEDCHIPLED_1206:1  [CHIPLED_1206]
LED41  RED  LEDCHIPLED_1206:1  [CHIPLED_1206]
LED42  RED  LEDCHIPLED_1206:1  [CHIPLED_1206]
LED43  RED  LEDCHIPLED_1206:1  [CHIPLED_1206]
LED44  RED  LEDCHIPLED_1206:1  [CHIPLED_1206]
LED45  RED  LEDCHIPLED_1206:1  [CHIPLED_1206]
LED46  RED  LEDCHIPLED_1206:1  [CHIPLED_1206]
LED47  RED  LEDCHIPLED_1206:1  [CHIPLED_1206]
LED48  RED  LEDCHIPLED_1206:1  [CHIPLED_1206]
LED49  RED  LEDCHIPLED_1206:1  [CHIPLED_1206]
LED50  RED  LEDCHIPLED_1206:1  [CHIPLED_1206]
PWR  PINHD-1X3  [1X03]
R25  220  RESISTOR  [0805]
R26  220  RESISTOR  [0805]
R41  220  RESISTOR  [0805]
R42  220  RESISTOR  [0805]
R43  220  RESISTOR  [0805]
R44  220  RESISTOR  [0805]
R45  220  RESISTOR  [0805]
R46  220  RESISTOR  [0805]
RST  PINHD-1X3  [1X03]
S4  TAC_SWITCHSMD  [TACTILE_SWITCH_SMD:1]
TX_RX  PINHD-1X3  [1X03]

### Nets
GND_TRGT: ATTINY.P$8(GND) BAT.2(-) C44.1 JP2.6 JP9.6 PWR.1 RST.1 RST.2 S4.1 S4.2 TX_RX.2 ; supply symbol labelled GND ; also sheet 1
K0 [LED]: ATTINY.P$12((OC0A)PB2) R43.1
K1 [LED]: ATTINY.P$11((AIN1)PB1) R42.1
K2 [LED]: ATTINY.P$10((AIN0)PB0) R41.1
K3 [LED]: ATTINY.P$14((OC1B)PB4) R26.1
K4 [LED]: ATTINY.P$13((OC1A)PB3) R25.1
K5: ATTINY.P$9((ICP)PD6) R45.1
K6: ATTINY.P$7((T1)PD5) R46.1
K7: ATTINY.P$6((T0)PD4) R44.1
MISO: ATTINY.P$16((MISO)PB6) JP2.2 JP9.2
MOSI: ATTINY.P$15((MOSI)PB5) JP2.1 JP9.1
PB0: LED7.C LED8.A LED17.C LED18.A LED25.C LED26.A LED31.C LED32.A LED35.A LED36.C LED39.C LED40.C R41.2
PB1: LED5.C LED6.A LED15.C LED16.A LED23.C LED24.A LED31.A LED32.C LED33.A LED34.C LED37.C LED38.C R42.2
PB2 [LED]: LED3.C LED4.A LED21.A LED22.C LED23.A LED24.C LED25.A LED26.C LED27.A LED28.C LED29.A LED30.C R43.2
PB3: LED11.C LED12.A LED13.C LED14.A LED15.A LED16.C LED17.A LED18.C LED19.A LED20.C LED21.C LED22.A LED49.C LED50.A R25.2
PB4: LED3.A LED4.C LED5.A LED6.C LED7.A LED8.C LED9.A LED10.C LED11.A LED12.C LED43.C LED44.A LED47.C LED48.A R26.2
PD2: ATTINY.P$5((INT1)PD3) S4.4
PD4: LED45.A LED46.C LED47.A LED48.C LED49.A LED50.C R44.2
PD5 [LED]: LED13.A LED14.C LED37.A LED38.A LED39.A LED40.A LED41.C LED42.A LED43.A LED44.C LED45.C LED46.A R46.2
PD6: LED9.C LED10.A LED19.C LED20.A LED27.C LED28.A LED29.C LED30.A LED33.C LED34.A LED35.C LED36.A LED41.A LED42.C R45.2
RST: ATTINY.P$19(PA2(/RESET)) JP2.5 JP9.5 RST.3
RXD: ATTINY.P$20((RXD)PD0) TX_RX.3
SCK: ATTINY.P$17((UCSK)PB7) JP2.3 JP9.3
TXD: ATTINY.P$1((TXD)PD1) TX_RX.1
VCC: ATTINY.P$18(VCC) BAT.1(+) C44.2 JP2.4 JP9.4 PWR.2 PWR.3
Unconnected: ATTINY.P$2(PA1(XTAL2)) ATTINY.P$3(PA0(XTAL1)) ATTINY.P$4((INT0)PD2) S4.3

## Library data of the parts
_3V3_CTRL _GLITCH_CTRL FET SWITCH_PWR = L1_2025_v1.3:0R-JUMP: SMD 0R 0805 Jumper
ADC = L1_2025_DevBoard_v1.2:PINHD-1X3*?:1: PIN HEADER
AFID1 AFID2 = L1_2025_v1.3:FIDUCIAL: For use by pick and place machines to calibrate the vision/machine, 1mm By microbuilder.eu
ATTINY = L1_2025_v1.3:TINY2313*: Atmel Tiny2313 2K Flash, 128 bytes EEPROM, 128 bytes RAM
BAT = L1_2025_v1.3:SPARKFUN_BATTERY: Battery Holders Various common sizes : AA, AAA, 20mm coin cell and 12mm coin cell.
C1-C49 = L1_2025_v1.3:CAP: Capacitor Standard 0603 ceramic capacitor, and 0.1" leaded capacitor.
D1 = L1_2025_v1.3:RB500VM-40TE-17: Schottky Diode 100mA 45V SOD-323FL Source: Datasheet <https://fscdn.rohm.com/en/products/databook/datasheet/discrete/diode/schottky_barrier/rb500vm-40te-17-e.pdf>; DESCRIPTION: Schottky Diode 100mA 45V SOD-323FL; HEIGHT: 0.9mm; MANUFACTURER_NAME: ROHM Semiconductor; MANUFACTURER_PART_NUMBER: RB500VM-40TE-17; MOUSER_PART_NUMBER: 755-RB500VM-40TE-17; MOUSER_PRICE-STOCK: https://www.mouser.co.uk/ProductDetail/ROHM-Semiconductor/RB500VM-40TE-17?qs=lrf6x%2Foh5fBhvDf%252BYRXs8Q%3D%3D
F1 = L1_2025_v1.3:PTCFUSE: PTC fuses, resettable thermistors
GLITCH MEASURE = L1_2025_v1.3:SMACONNECTOR: SMA Connector 90° DIP SMA Connector, 50 Ohm (4UConnector: 07259)
GND LOW RUN = L1_2025_v1.3:PTR1: TEST PIN
IC1 = L1_2025_v1.3:XC6210B332MR-G: LDO Voltage Regulators 700mA High Speed Votage Regulator Source: Datasheet <https://www.torexsemi.com/file/xc6210/XC6210.pdf>; DESCRIPTION: LDO Voltage Regulators 700mA High Speed Votage Regulator; HEIGHT: 1.3mm; MANUFACTURER_NAME: Torex; MANUFACTURER_PART_NUMBER: XC6210B332MR-G; MOUSER_PART_NUMBER: 865-XC6210B332MR-G; MOUSER_PRICE-STOCK: https://www.mouser.co.uk/ProductDetail/Torex-Semiconductor/XC6210B332MR-G?qs=AsjdqWjXhJ%2FS4LOuBYdYHQ%3D%3D
IC2 = L1_2025_v1.3:ADAFRUIT_MICRO_RP2040
IC4 = L1_2025_v1.3:ICE40UP5K-SG48ITR: FPGA - Field Programmable Gate Array iCE40-UltraPlus, 5280 LUTs, 1.2V Source: Datasheet <https://www.arrow.com/en/products/ice40up5k-sg48itr/lattice-semiconductor>; ARROW_PART_NUMBER: ICE40UP5K-SG48ITR; ARROW_PRICE-STOCK: https://www.arrow.com/en/products/ice40up5k-sg48itr/lattice-semiconductor?region=nac; DESCRIPTION: FPGA - Field Programmable Gate Array iCE40-UltraPlus, 5280 LUTs, 1.2V; HEIGHT: 1mm; MANUFACTURER_NAME: Lattice Semiconductor; MANUFACTURER_PART_NUMBER: ICE40UP5K-SG48ITR; MOUSER_PART_NUMBER: 842-40UP5KSG48ITR; MOUSER_PRICE-STOCK: https://www.mouser.com/Search/Refine.aspx?Keyword=842-40UP5KSG48ITR
IC5 = L1_2025_v1.3:TLV77333PDBVR: High PSRR: Up to 80dB 72dB (1kHz) 55dB (1MHz) VIN range: 1.4V to 5.5V Fixed output voltage range: 0.6V to 3.3V Output voltage accuracy: 2% Low dropout voltage: 180mV at 300mA (3.3VOUT, DQN package) Foldback current limit Active output pulldown resistor Source: Datasheet <https://www.ti.com/lit/ds/symlink/tlv773.pdf?ts=1724142940835&ref_url=https%3A%2F%2Fwww.mouser.in%2F>; DESCRIPTION: High PSRR: Up to 80dB 72dB (1kHz) 55dB (1MHz) VIN range: 1.4V to 5.5V Fixed output voltage range: 0.6V to 3.3V Output voltage accuracy: 2% Low dropout voltage: 180mV at 300mA (3.3VOUT, DQN package) Foldback current limit Active output pulldown resistor; HEIGHT: 1.45mm; MANUFACTURER_NAME: Texas Instruments; MANUFACTURER_PART_NUMBER: TLV77333PDBVR
IC6 IC7 = L1_2025_v1.3:TLV77325PDBVR: LDO Voltage Regulators 300-mA high-PSRR low-IQ low-dropout regulator with enable Source: Datasheet <https://www.mouser.com/ProductDetail/Texas-Instruments/TLV77325PDBVR?qs=i8QVZAFTkqRX2VRUOXqXsg==>; DESCRIPTION: LDO Voltage Regulators 300-mA high-PSRR low-IQ low-dropout regulator with enable; HEIGHT: 1.45mm; MANUFACTURER_NAME: Texas Instruments; MANUFACTURER_PART_NUMBER: TLV77325PDBVR; MOUSER_PART_NUMBER: 595-TLV77325PDBVR; MOUSER_PRICE-STOCK: https://www.mouser.co.uk/ProductDetail/Texas-Instruments/TLV77325PDBVR?qs=i8QVZAFTkqRX2VRUOXqXsg%3D%3D
IC8 = L1_2025_v1.3:MAX4583EEE+: Analogue Switch ICs Low-Voltage, CMOS Analog Multiplexers/Switches Source: Datasheet <https://datasheets.maximintegrated.com/en/ds/MAX4581-MAX4583.pdf>; DESCRIPTION: Analogue Switch ICs Low-Voltage, CMOS Analog Multiplexers/Switches; HEIGHT: 1.75mm; MANUFACTURER_NAME: Analog Devices; MANUFACTURER_PART_NUMBER: MAX4583EEE+; MOUSER_PART_NUMBER: 700-MAX4583EEE; MOUSER_PRICE-STOCK: https://www.mouser.co.uk/ProductDetail/Analog-Devices-Maxim-Integrated/MAX4583EEE%2b?qs=LHmEVA8xxfZWpGZ4exmtgg%3D%3D
IC9 IC10 = L1_2025_v1.3:74AUP1T17GWH: 74AUP1T17 - Low-power buffer with voltage-level translator@en-us Source: Datasheet <https://assets.nexperia.com/documents/data-sheet/74AUP1T17.pdf>; ARROW_PART_NUMBER: 74AUP1T17GWH; ARROW_PRICE-STOCK: https://www.arrow.com/en/products/74aup1t17gwh/nexperia?region=nac; DESCRIPTION: 74AUP1T17 - Low-power buffer with voltage-level translator@en-us; HEIGHT: 1.1mm; MANUFACTURER_NAME: Nexperia; MANUFACTURER_PART_NUMBER: 74AUP1T17GWH; MOUSER_PART_NUMBER: 771-74AUP1T17GWH; MOUSER_PRICE-STOCK: https://www.mouser.co.uk/ProductDetail/Nexperia/74AUP1T17GWH?qs=W0yvOO0ixfEkWoP8%252BUBOfA%3D%3D
IC11 = L1_2025_v1.3:INA216A2RSWR: 5V, Low-Power, High-side, Zero-Drift, Voltage Output Current Shunt Monitor in WCSP or QFN Package Source: Datasheet <http://www.ti.com/lit/gpn/ina216>; DESCRIPTION: 5V, Low-Power, High-side, Zero-Drift, Voltage Output Current Shunt Monitor in WCSP or QFN Package; HEIGHT: 0.5mm; MANUFACTURER_NAME: Texas Instruments; MANUFACTURER_PART_NUMBER: INA216A2RSWR; MOUSER_PART_NUMBER: 595-INA216A2RSWR; MOUSER_PRICE-STOCK: https://www.mouser.com/Search/Refine.aspx?Keyword=595-INA216A2RSWR
IC12 IC14 = L1_2025_v1.3:W25Q32JVSSIQ_TR: NOR Flash spiFlash, 32M-bit, DTR, 4Kb Uniform Sector Source: Datasheet <https://www.winbond.com/resource-files/w25q32jv spi revc 08302016.pdf>; ARROW_PART_NUMBER: W25Q32JVSSIQ TR; ARROW_PRICE-STOCK: https://www.arrow.com/en/products/w25q32jvssiqtr/winbond-electronics?utm_currency=USD&region=nac; DESCRIPTION: NOR Flash spiFlash, 32M-bit, DTR, 4Kb Uniform Sector; HEIGHT: 2.16mm; MANUFACTURER_NAME: Winbond; MANUFACTURER_PART_NUMBER: W25Q32JVSSIQ TR; MOUSER_PART_NUMBER: 454-W25Q32JVSSIQTR; MOUSER_PRICE-STOCK: https://www.mouser.co.uk/ProductDetail/Winbond/W25Q32JVSSIQ-TR?qs=qSfuJ%252Bfl%2Fd73AdQzQa%2FEuA%3D%3D
IC13 = L1_2025_v1.3:APS6404L-3SQN-SN: DRAM IoT RAM 64Mb QSPI (x1,x4) SDR 133MHz, 3V, Ind. Temp., SOP8 Source: Datasheet <https://www.apmemory.com/wp-content/uploads/APM_PSRAM_E3_QSPI-APS6404L-3SQN-v2.4-KGD_PKG.pdf>; DESCRIPTION: DRAM IoT RAM 64Mb QSPI (x1,x4) SDR 133MHz, 3V, Ind. Temp., SOP8; HEIGHT: 1.75mm; MANUFACTURER_NAME: AP Memory; MANUFACTURER_PART_NUMBER: APS6404L-3SQN-SN; MOUSER_PART_NUMBER: 878-APS6404L-3SQN-SN; MOUSER_PRICE-STOCK: https://www.mouser.co.uk/ProductDetail/AP-Memory/APS6404L-3SQN-SN?qs=IS%252B4QmGtzzqCot9%252BeIJwKw%3D%3D
ICE_DONE POWER = L1_2025_v1.3:LED: LEDs Standard schematic elements and footprints for 5mm, 3mm, 1206, and 0603 sized LEDs. 5mm - Spark Fun Electronics SKU : COM-00529 (and others)
ICE_USR RP_BOOT RP_RST = L1_2025_v1.3:SWITCH-MOMENTARY-2
J1 = L1_2025_v1.3:USB4105-GF-A: USB-C (USB TYPE-C) USB 2.0 Receptacle Connector 24 (16+8 Dummy) Position Surface Mount, Right Angle; Through Hole Check availability <https://pricing.snapeda.com/parts/USB4105-GF-A/GCT/view-part?ref=eda>; AVAILABILITY: In Stock; DESCRIPTION: USB-C (USB TYPE-C) USB 2.0 Receptacle Connector 24 (16+8 Dummy) Position Surface Mount, Right Angle; Through Hole; MF: GCT; MP: USB4105-GF-A; PACKAGE: None; PRICE: None; PURCHASE-URL: https://pricing.snapeda.com/search/part/USB4105-GF-A/?ref=eda
J2 = L1_2025_v1.3:BM03B-SRSS-TB_LF__SN_: Connector Header Surface Mount 3 position 0.039" (1.00mm) 1A 50V -25C ~ 85C Source: Datasheet <https://www.jst.com/wp-content/uploads/2021/03/eSR_SZ-new.pdf>; ARROW_PART_NUMBER: BM03B-SRSS-TB(LF)(SN); ARROW_PRICE-STOCK: https://www.arrow.com/en/products/bm03b-srss-tb-lf-sn/jst-manufacturing?region=europe; DESCRIPTION: Connector Header Surface Mount 3 position 0.039" (1.00mm) 1A 50V -25C ~ 85C; HEIGHT: 4.25mm; MANUFACTURER_NAME: JST (JAPAN SOLDERLESS TERMINALS); MANUFACTURER_PART_NUMBER: BM03B-SRSS-TB(LF)(SN); MOUSER_PART_NUMBER: 306-BM03BSRSSTBLFSNP; MOUSER_PRICE-STOCK: https://www.mouser.co.uk/ProductDetail/JST-Commercial/BM03B-SRSS-TBLFSN?qs=cdbOS8ANM9ApPnI10xgS6Q%3D%3D
JP1 JP3-JP5 = L1_2025_v1.3:PINHD-1X2: PIN HEADER
JP2 = L1_2025_v1.3:SPARKFUN-CONNECTORS_M06: Header 6 Standard 6-pin 0.1" header. Use with straight break away headers (SKU : PRT-00116), right angle break away headers (PRT-00553), swiss pins (PRT-00743), machine pins (PRT-00117), and female headers (PRT-00115). Molex polarized connector foot print use with SKU : PRT-08094 with associated crimp pins and housings. NOTES ON THE VARIANTS LOCK and LOCK_LONGPADS... This footprint was designed to help hold the alignment of a through-hole component (i.e. 6-pin header) while soldering it into place. You may notice that each hole has been shifted either up or down by 0.005 of an inch from it's more standard position (which is a perfectly straight line). This slight alteration caused the pins (the squares in the middle) to touch the edges of the holes. Because they are alternating, it causes a "brace" to hold the component in place. 0.005 has proven to be the perfect amount of "off-center" position when using our standard breakaway headers. Although looks a little odd when you look at the bare footprint, once you have a header in there, the alteration is very hard to notice. Also,if you push a header all the way into place, it is covered up entirely on the bottom side. This idea of altering the position of holes to aid alignment will be further integrated into the Sparkfun Library for other footprints. It can help hold any component with 3 or more connection pins.
JP6 = L1_2025_v1.3:PINHD-1X4: PIN HEADER
JP7 JP8 = L1_2025_v1.3:PINHD-2X20: PIN HEADER
JP9 = L1_2025_v1.3:ADAFRUIT_PINHD-1X6: PIN HEADER
LED1 = L1_2025_v1.3:RGBLED: For 5050 RGB LEDs, the order of the LEDs may vary from one manufacturer to another!
LED3-LED50 = L1_2025_DevBoard_v1.2:LED*?:1: LED OSRAM: - CHIPLED LG R971, LG N971, LY N971, LG Q971, LY Q971, LO R971, LY R971 LH N974, LH R974 LS Q976, LO Q976, LY Q976 LO Q996 - Hyper CHIPLED LW Q18S LB Q993, LB Q99A, LB R99A - SideLED LS A670, LO A670, LY A670, LG A670, LP A670 LB A673, LV A673, LT A673, LW A673 LH A674 LY A675 LS A676, LA A676, LO A676, LY A676, LW A676 LS A679, LY A679, LG A679 - Hyper Micro SIDELED® LS Y876, LA Y876, LO Y876, LY Y876 LT Y87S - SmartLED LW L88C, LW L88S LB L89C, LB L89S, LG L890 LS L89K, LO L89K, LY L89K LS L896, LA L896, LO L896, LY L896 - TOPLED LS T670, LO T670, LY T670, LG T670, LP T670 LSG T670, LSP T670, LSY T670, LOP T670, LYG T670 LG T671, LOG T671, LSG T671 LB T673, LV T673, LT T673, LW T673 LH T674 LS T676, LA T676, LO T676, LY T676, LB T676, LH T676, LSB T676, LW T676 LB T67C, LV T67C, LT T67C, LS T67K, LO T67K, LY T67K, LW E67C LS E67B, LA E67B, LO E67B, LY E67B, LB E67C, LV E67C, LT E67C LW T67C LS T679, LY T679, LG T679 LS T770, LO T770, LY T770, LG T770, LP T770 LB T773, LV T773, LT T773, LW T773 LH T774 LS E675, LA E675, LY E675, LS T675 LS T776, LA T776, LO T776, LY T776, LB T776 LHGB T686 LT T68C, LB T68C - Hyper Mini TOPLED® LB M676 - Mini TOPLED Santana® LG M470 LS M47K, LO M47K, LY M47K Source: http://www.osram.convergy.de LUXEON: - LUMILED® LXK2-PW12-R00, LXK2-PW12-S00, LXK2-PW14-U00, LXK2-PW14-V00 LXK2-PM12-R00, LXK2-PM12-S00, LXK2-PM14-U00 LXK2-PE12-Q00, LXK2-PE12-R00, LXK2-PE12-S00, LXK2-PE14-T00, LXK2-PE14-U00 LXK2-PB12-K00, LXK2-PB12-L00, LXK2-PB12-M00, LXK2-PB14-N00, LXK2-PB14-P00, LXK2-PB14-Q00 LXK2-PR12-L00, LXK2-PR12-M00, LXK2-PR14-Q00, LXK2-PR14-R00 LXK2-PD12-Q00, LXK2-PD12-R00, LXK2-PD12-S00 LXK2-PH12-R00, LXK2-PH12-S00 LXK2-PL12-P00, LXK2-PL12-Q00, LXK2-PL12-R00 Source: www.luxeon.com KINGBRIGHT: KA-3528ASYC Source: www.kingbright.com
PS1 PS2 = L1_2025_v1.3:TLV75801PDBVR: Adjustable 500-mA low-dropout (LDO) regulator Source: Datasheet <http://www.ti.com/lit/ds/symlink/tlv758p.pdf>; ARROW_PART_NUMBER: TLV75801PDBVR; ARROW_PRICE-STOCK: https://www.arrow.com/en/products/tlv75801pdbvr/texas-instruments?utm_currency=USD&region=nac; DESCRIPTION: Adjustable 500-mA low-dropout (LDO) regulator; HEIGHT: 1.45mm; MANUFACTURER_NAME: Texas Instruments; MANUFACTURER_PART_NUMBER: TLV75801PDBVR; MOUSER_PART_NUMBER: 595-TLV75801PDBVR; MOUSER_PRICE-STOCK: https://www.mouser.co.uk/ProductDetail/Texas-Instruments/TLV75801PDBVR?qs=vLWxofP3U2xDujOQuzp8eQ%3D%3D
PWR RST SWD TX_RX UART = L1_2025_v1.3:PINHD-1X3: PIN HEADER
Q1 = L1_2025_v1.3:RF4E070GNTR: 4.5V Drive Nch MOSFET Source: Datasheet <https://fscdn.rohm.com/en/products/databook/datasheet/discrete/transistor/mosfet/rf4e070gntr-e.pdf>; DESCRIPTION: 4.5V Drive Nch MOSFET; HEIGHT: 0.65mm; MANUFACTURER_NAME: ROHM Semiconductor; MANUFACTURER_PART_NUMBER: RF4E070GNTR; MOUSER_PART_NUMBER: 755-RF4E070GNTR; MOUSER_PRICE-STOCK: https://www.mouser.co.uk/ProductDetail/ROHM-Semiconductor/RF4E070GNTR?qs=m1T3c8F5IUJtbCRpVs9XOQ%3D%3D
Q2 = L1_2025_v1.3:2N7002PW: Trench MOSFET,N channel 60V,310mA SOT323 NXP 2N7002PW N-channel MOSFET Transistor, 0.31 A, 60 V, 3-Pin SOT-323 Source: Datasheet <https://datasheet.datasheetarchive.com/originals/distributors/Datasheets-NXP/DSANXP01000632.pdf>; DESCRIPTION: Trench MOSFET,N channel 60V,310mA SOT323 NXP 2N7002PW N-channel MOSFET Transistor, 0.31 A, 60 V, 3-Pin SOT-323; HEIGHT: 1.1mm; MANUFACTURER_NAME: Nexperia; MANUFACTURER_PART_NUMBER: 2N7002PW; MOUSER_PART_NUMBER: N/A; MOUSER_PRICE-STOCK: https://www.mouser.co.uk/ProductDetail/Nexperia/2N7002PW?qs=vHuUswq2%252Bsyvffi%2FgVnx%2FA%3D%3D
R1-R11 R13-R24 R27-R40 R47-R51 = L1_2025_DevBoard_v1.2:RESISTOR*?:1: Resistor Basic schematic elements and footprints for 0603, 1206, and PTH 1/10th watt (small) resistors.
R25 R26 R41-R46 = L1_2025_v1.3:RESISTOR: Resistor Basic schematic elements and footprints for 0603, 1206, and PTH 1/10th watt (small) resistors.
S4 = L1_2025_v1.3:TAC_SWITCH: Momentary Switch Button commonly used for reset or general input. Spark Fun Electronics SKU : COM-00097
SJ2 VCORE = L1_2025_v1.3:SJ: SMD solder JUMPER
TP1-TP3 = L1_2025_v1.3:TESTPAD_TPS: TEST PIN
VR1 VR2 = L1_2025_v1.3:TC33X-2-104E: Cermet 3mm SMT trimmer,0.1W 100k Bourns TC33 Series SMD Cermet Trimmer Resistor with Solder Pad Terminations, 100k +/-25% 1/10W +/-250ppm/C Top Adjust Source: Datasheet <https://www.bourns.com/pdfs/TC33.pdf>; ARROW_PART_NUMBER: TC33X-2-104E; ARROW_PRICE-STOCK: https://www.arrow.com/en/products/tc33x-2-104e/bourns?utm_currency=USD&region=nac; DESCRIPTION: Cermet 3mm SMT trimmer,0.1W 100k Bourns TC33 Series SMD Cermet Trimmer Resistor with Solder Pad Terminations, 100k +/-25% 1/10W +/-250ppm/C Top Adjust; HEIGHT: 1.2mm; MANUFACTURER_NAME: Bourns; MANUFACTURER_PART_NUMBER: TC33X-2-104E; MOUSER_PART_NUMBER: 652-TC33X-2-104E; MOUSER_PRICE-STOCK: https://www.mouser.co.uk/ProductDetail/Bourns/TC33X-2-104E?qs=2hAPiALdQ0llyX8B3WfcDg%3D%3D
Y1 = L1_2025_v1.3:ABM8-272-T3_ABM8-272-T3: Crystal, 12 MHz, SMD, 3.2mm x 2.5mm, 30 ppm, 10 pF, 30 ppm, ABM8 Series Source: Datasheet <https://abracon.com/datasheets/ABM8-272-T3.pdf>; DESCRIPTION: Crystal, 12 MHz, SMD, 3.2mm x 2.5mm, 30 ppm, 10 pF, 30 ppm, ABM8 Series; HEIGHT: 0.8mm; MANUFACTURER_NAME: ABRACON; MANUFACTURER_PART_NUMBER: ABM8-272-T3; MOUSER_PART_NUMBER: 815-ABM8-272-T3; MOUSER_PRICE-STOCK: https://www.mouser.co.uk/ProductDetail/ABRACON/ABM8-272-T3?qs=QpmGXVUTftEj6miOiJBMxQ%3D%3D

## Net classes
1 LED: width 0.203 mm